# EAGLE design v1 (EAGLE 9.2.2)
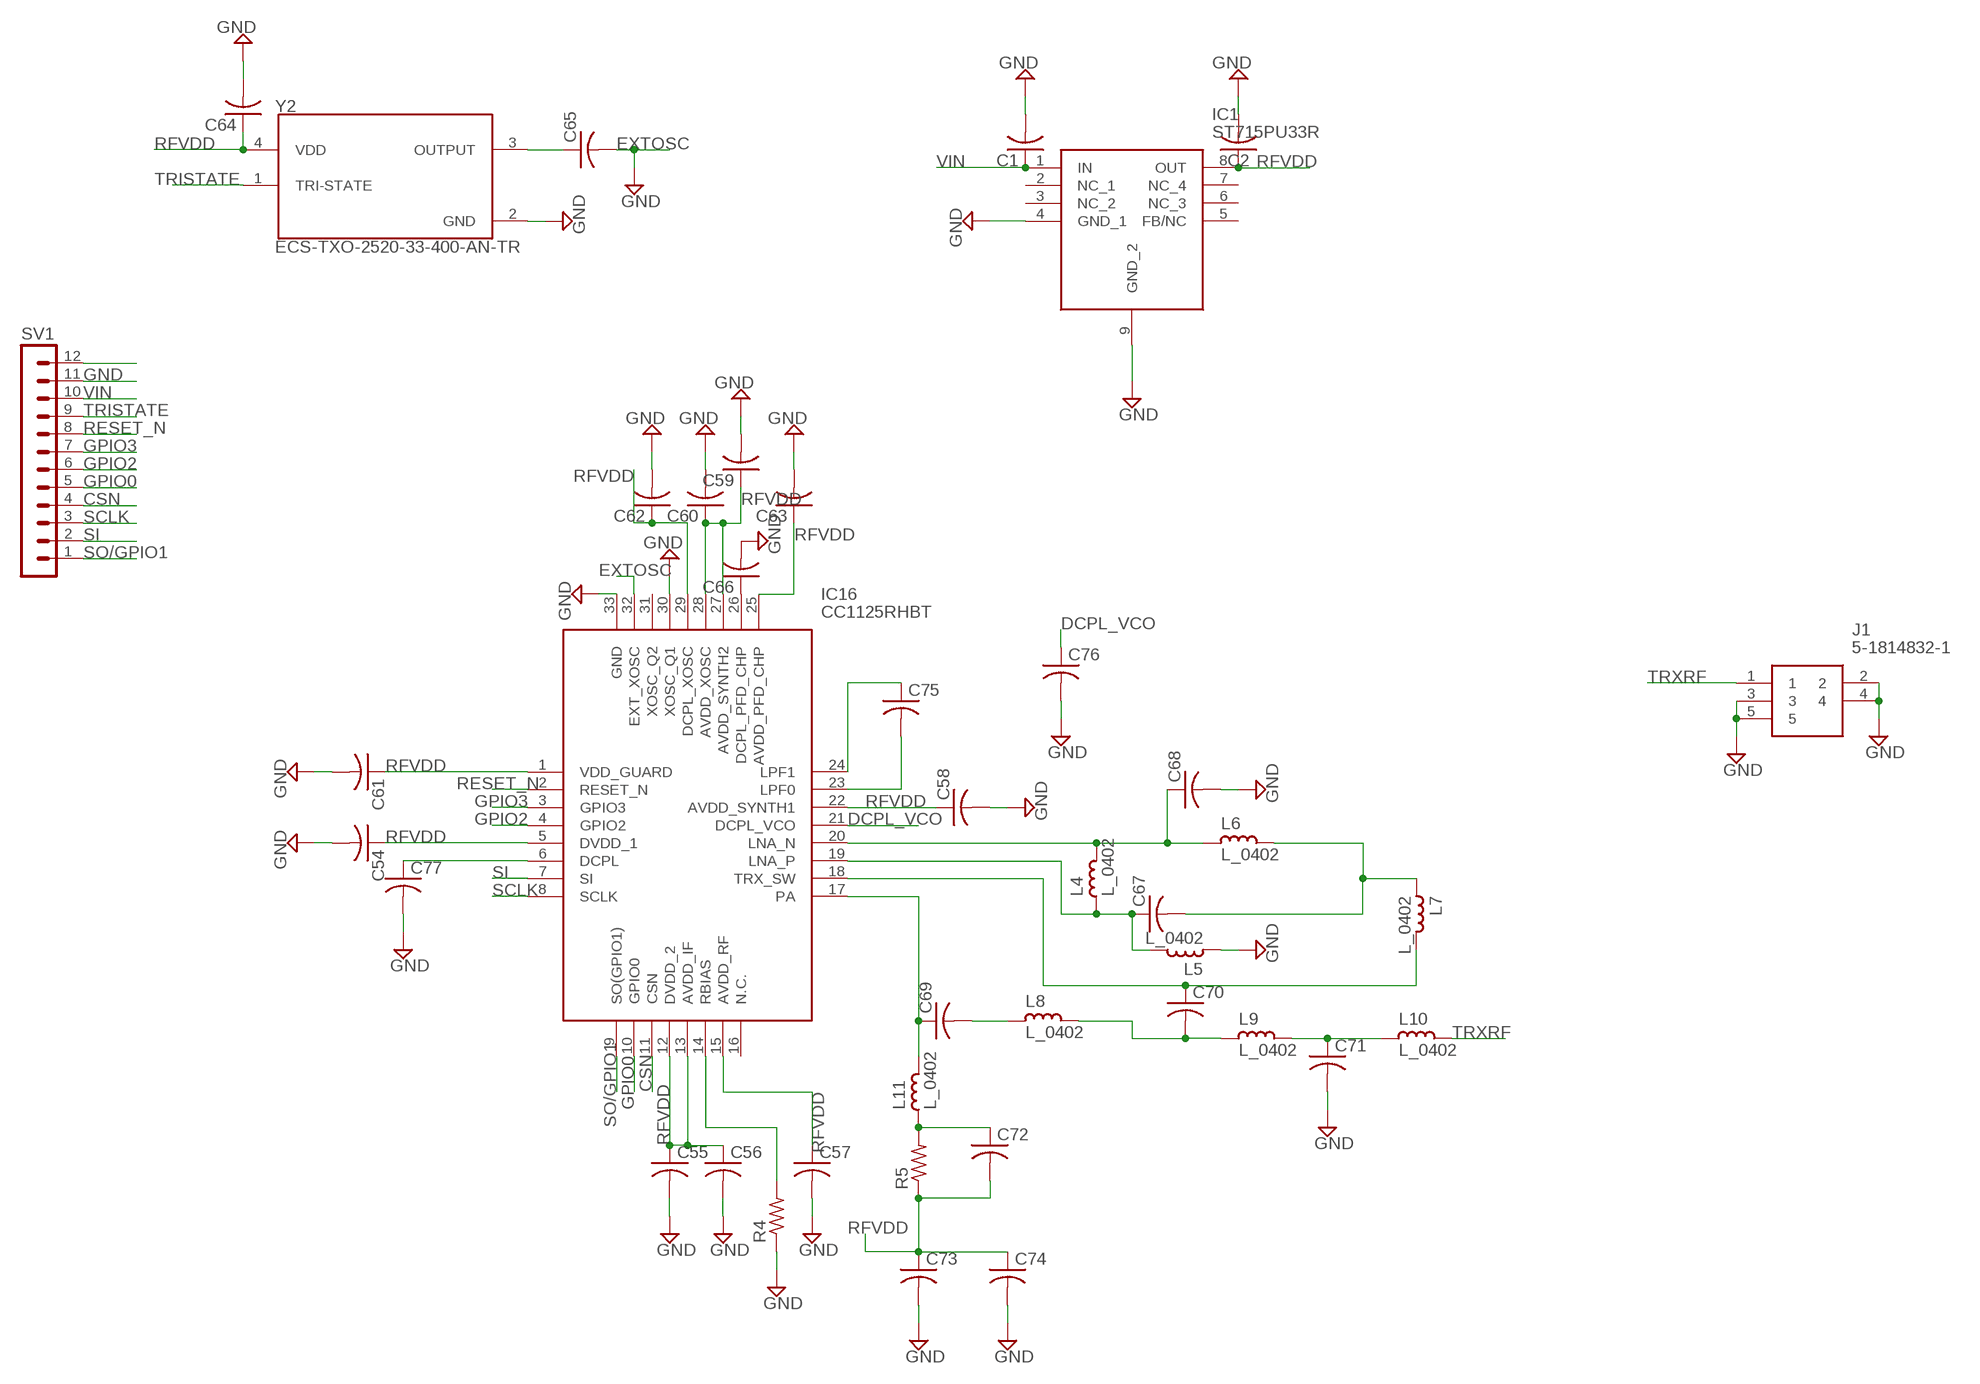
[diagram p0: schematic, sheet 1]

## Parts
C1  C-USC0402  [C0402]
C2  C-USC0402  [C0402]
C54  C-USC0402  [C0402]
C55  C-USC0402  [C0402]
C56  C-USC0402  [C0402]
C57  C-USC0805  [C0805]
C58  C-USC0402  [C0402]
C59  C-USC0402  [C0402]
C60  C-USC0402  [C0402]
C61  C-USC0805  [C0805]
C62  C-USC0402  [C0402]
C63  C-USC0805  [C0805]
C64  C-USC0805  [C0805]
C65  C-USC0402  [C0402]
C66  C-USC0402  [C0402]
C67  C-USC0402  [C0402]
C68  C-USC0402  [C0402]
C69  C-USC0402  [C0402]
C70  C-USC0402  [C0402]
C71  C-USC0402  [C0402]
C72  C-USC0402  [C0402]
C73  C-USC0402  [C0402]
C74  C-USC0402  [C0402]
C75  C-USC0402  [C0402]
C76  C-USC0402  [C0402]
C77  C-USC0402  [C0402]
IC1  ST715PU33R  [SON65P300X300X100-9N]
IC16  CC1125RHBT  [QFN50P500X500X100-33N]
J1  5-1814832-1  [5-1814832-1]
L4  L_0402  [L0402]
L5  L_0402  [L0402]
L6  L_0402  [L0402]
L7  L_0402  [L0402]
L8  L_0402  [L0402]
L9  L_0402  [L0402]
L10  L_0402  [L0402]
L11  L_0402  [L0402]
R4  R-US_R0402  [R0402]
R5  R-US_R0402  [R0402]
SV1  MA12-1  [MA12-1]
Y2  ECS-TXO-2520-33-400-AN-TR  [OSC_ECS-TXO-2520-33-400-AN-TR]

## Nets
CSN [50feed]: IC16.11(CSN) SV1.4
DCPL_VCO: C76.1 IC16.21(DCPL_VCO)
EXTOSC: C65.2 IC16.32(EXT_XOSC) ; supply symbol labelled GND
GND [50feed]: C1.2 C2.2 C54.2 C55.2 C56.2 C57.2 C58.2 C59.2 C60.2 C61.2 C62.2 C63.2 C64.2 C66.2 C68.2 C71.2 C73.2 C74.2 C76.2 C77.2 IC1.4(GND_1) IC1.9(GND_2) IC16.30(XOSC_Q1) IC16.33(GND) J1.2 J1.3 J1.4 J1.5 L5.2 R4.1 SV1.11 Y2.2(GND)
GPIO0 [50feed]: IC16.10(GPIO0) SV1.5
GPIO2 [50feed]: IC16.4(GPIO2) SV1.6
GPIO3 [50feed]: IC16.3(GPIO3) SV1.7
N$12 [50feed]: SV1.12
N$109: IC16.14(RBIAS) R4.2
N$117: C65.1 Y2.3(OUTPUT)
N$121: C66.1 IC16.26(DCPL_PFD_CHP)
N$122 [50feed]: C68.1 IC16.20(LNA_N) L4.1 L6.2
N$123 [50feed]: C67.1 IC16.19(LNA_P) L4.2 L5.1
N$124 [50feed]: C67.2 L6.1 L7.2
N$127 [50feed]: C70.1 IC16.18(TRX_SW) L7.1
N$129 [50feed]: C69.1 IC16.17(PA) L11.1
N$130 [50feed]: C69.2 L8.2
N$131 [50feed]: C70.2 L8.1 L9.2
N$132 [50feed]: C71.1 L9.1 L10.2
N$136: C72.1 L11.2 R5.2
N$140: C77.1 IC16.6(DCPL)
N$141: C75.2 IC16.23(LPF0)
N$142: C75.1 IC16.24(LPF1)
RESET_N [50feed]: IC16.2(RESET_N) SV1.8
RFVDD: C2.1 C54.1 C55.1 C56.1 C57.1 C58.1 C59.1 C60.1 C61.1 C62.1 C63.1 C64.1 C72.2 C73.1 C74.1 IC1.8(OUT) IC16.1(VDD_GUARD) IC16.5(DVDD_1) IC16.12(DVDD_2) IC16.13(AVDD_IF) IC16.15(AVDD_RF) IC16.22(AVDD_SYNTH1) IC16.25(AVDD_PFD_CHP) IC16.27(AVDD_SYNTH2) IC16.28(AVDD_XOSC) IC16.29(DCPL_XOSC) R5.1 Y2.4(VDD)
SCLK [50feed]: IC16.8(SCLK) SV1.3
SI [50feed]: IC16.7(SI) SV1.2
SO/GPIO1 [50feed]: IC16.9(SO(GPIO1)) SV1.1
TRISTATE [50feed]: SV1.9 Y2.1(TRI-STATE)
TRXRF [50feed]: J1.1 L10.1
VIN [50feed]: C1.1 IC1.1(IN) SV1.10
Unconnected: IC1.2(NC_1) IC1.3(NC_2) IC1.5(FB/NC) IC1.6(NC_3) IC1.7(NC_4) IC16.16(N.C.) IC16.31(XOSC_Q2)

## Library data of the parts
C1 C2 C54-C77 = rcl:C-US: CAPACITOR, American symbol; SPICEPREFIX: C
IC1 = ST715PU33R:ST715PU33R: LDO Voltage Regulators High Input Volt 85 mA LDO REG Source: Datasheet <https://componentsearchengine.com/Datasheets/1/ST715PU33R.pdf>; DESCRIPTION: LDO Voltage Regulators High Input Volt 85 mA LDO REG; HEIGHT: 1mm; MANUFACTURER_NAME: STMicroelectronics; MANUFACTURER_PART_NUMBER: ST715PU33R; MOUSER_PART_NUMBER: 511-ST715PU33R; MOUSER_PRICE-STOCK: https://www.mouser.com/Search/Refine.aspx?Keyword=511-ST715PU33R
IC16 = CC1125RHBT:CC1125RHBT: Ultra-High performance Sub-1 GHz Transceiver for Narrowband Systems Source: Datasheet <http://www.ti.com/general/docs/lit/getliterature.tsp?genericPartNumber=CC1125&&fileType=pdf>; DESCRIPTION: Ultra-High performance Sub-1 GHz Transceiver for Narrowband Systems; HEIGHT: 1mm; MANUFACTURER_NAME: Texas Instruments; MANUFACTURER_PART_NUMBER: CC1125RHBT; MOUSER_PART_NUMBER: 595-CC1125RHBT; MOUSER_PRICE-STOCK: https://www.mouser.com/Search/Refine.aspx?Keyword=595-CC1125RHBT
J1 = 5-1814832-1:5-1814832-1: SUBMINIATURE COAX Source: Datasheet <https://componentsearchengine.com/Datasheets/1/5-1814832-1.pdf>; DESCRIPTION: SUBMINIATURE COAX; HEIGHT: mm; MANUFACTURER_NAME: TE Connectivity; MANUFACTURER_PART_NUMBER: 5-1814832-1; MOUSER_PART_NUMBER: 571-5-1814832-1; MOUSER_PRICE-STOCK: https://www.mouser.com/Search/Refine.aspx?Keyword=571-5-1814832-1
L4-L11 = rc-master-smd:L_: INDUCTOR
R4 R5 = rcl:R-US_: RESISTOR, American symbol; SPICEPREFIX: R
SV1 = con-lstb:MA12-1: PIN HEADER; OC_FARNELL: unknown; OC_NEWARK: unknown
Y2 = ECS-TXO-2520-33-400-AN-TR:ECS-TXO-2520-33-400-AN-TR: miniatue SMD HCMOS TCXO Oscillator.; DESCRIPTION: Osc Tcxo 40.0mhz 3.3v Hcmos Smd; DIGI-KEY_PART_NUMBER: XC2260CT-ND; DIGI-KEY_PURCHASE_URL: https://www.digikey.com/product-detail/en/ecs-inc/ECS-TXO-2520-33-400-AN-TR/XC2260CT-ND/6578567?utm_source=snapeda&utm_medium=aggregator&utm_campaign=symbol; MF: ECS Inc.; MP: ECS-TXO-2520-33-400-AN-TR; PACKAGE: SMD-4 ECS International

## Net classes
1 50feed: width 0.147 mm

## Board
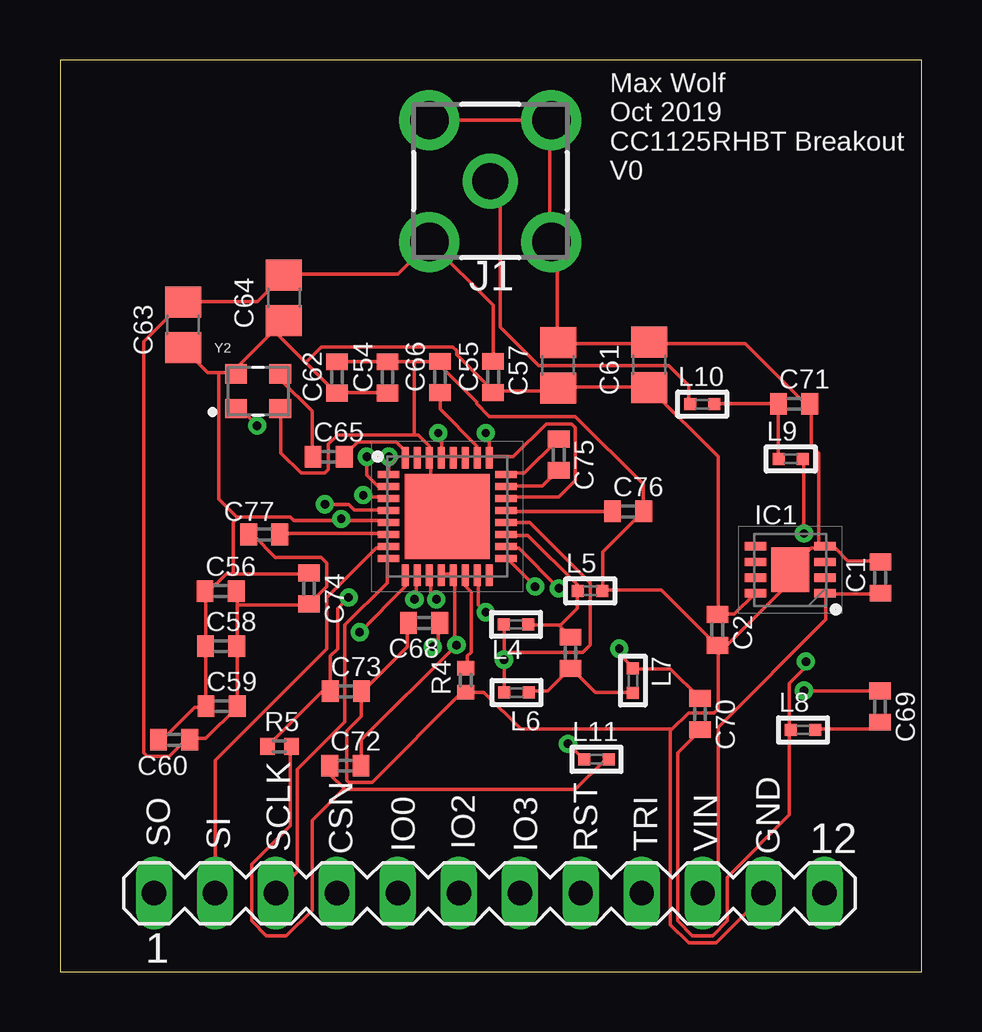
[diagram p1: board, top side]
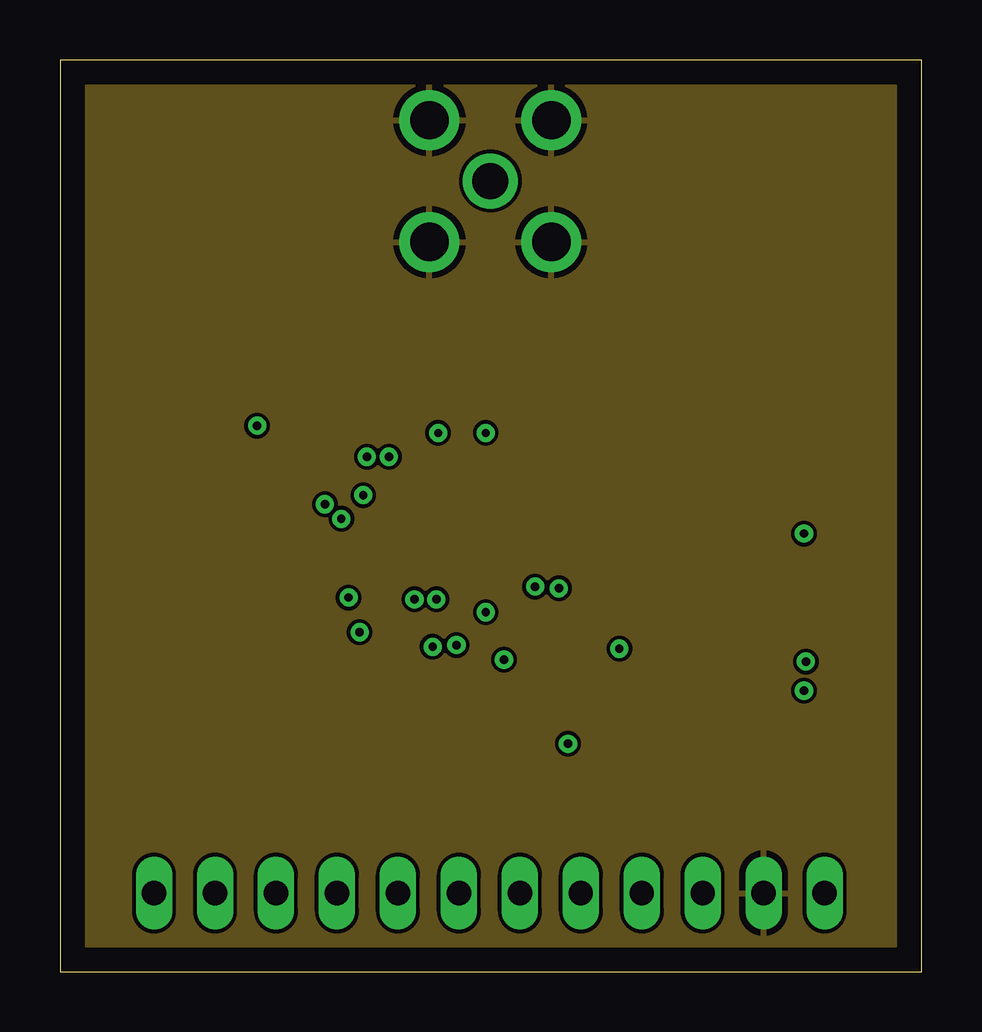
[diagram p2: board, inner layer Route2]
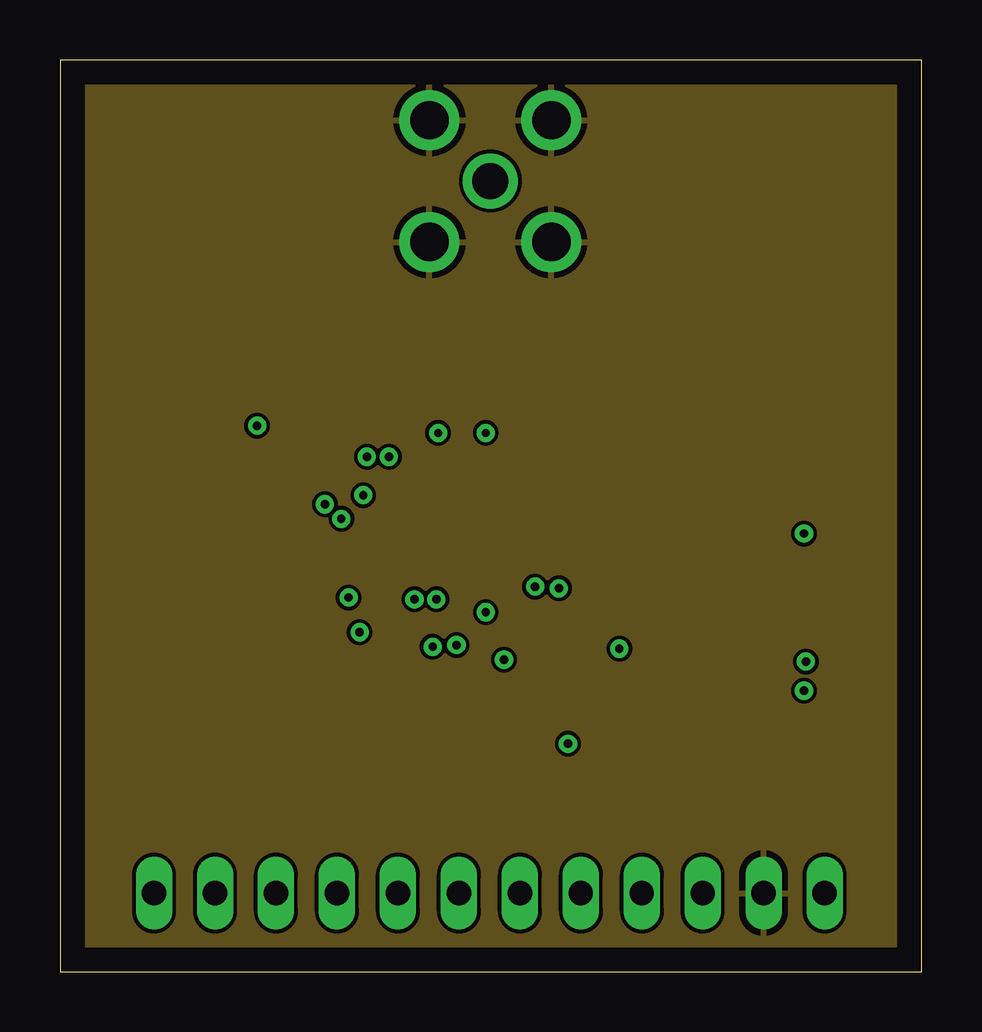
[diagram p3: board, inner layer Route15]
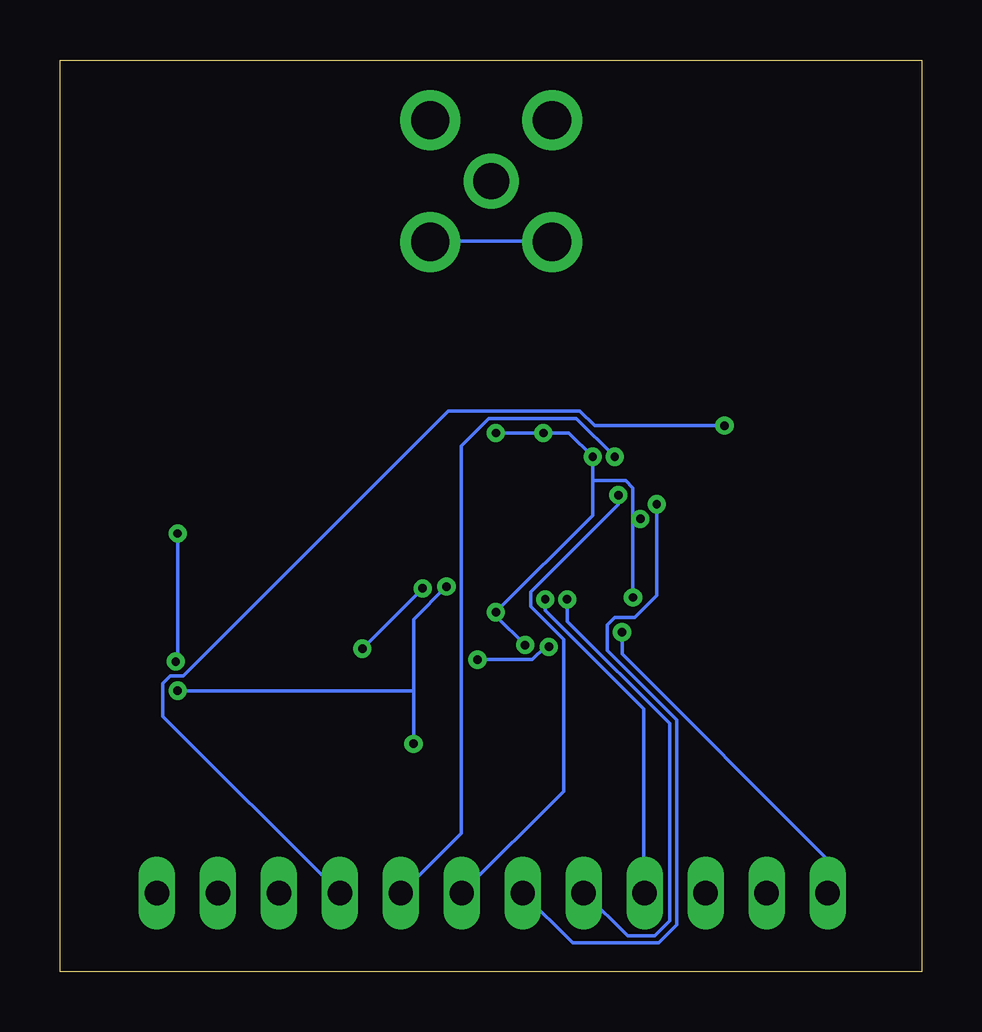
[diagram p4: board, bottom side, seen from below]

Size 35.9 x 38 mm. Coordinates in mm from the lower left corner, seen from the top.
Outline: 0,0 35.9,0 35.9,38 0,38 0,0
Copper layers (1+2*15+16): Top 0.035mm / dielectric 0.1mm / Route2 0.0175mm / dielectric 1.265mm / Route15 0.0175mm / dielectric 0.1mm / Bottom 0.035mm
Design rules "default *": minimum track width 6mil, minimum drill 0.35mm, track to track 6mil, track to pad 6mil, pad to pad 6mil, via to via 6mil, smd to smd 6mil, copper to edge 40mil, drill to drill 6mil, minimum pad ring 10mil, minimum via ring 8mil, stop-mask expansion 4mil, vias tented up to drill 0mil, thermal gap 10mil

### Footprints (pad centres in the part's own frame; a part is rotated, then mirrored left to right if it is on the bottom)
C0402 = smd 0.7 x 0.9: 1 -0.65,0; 2 0.65,0
C0805 = smd 1.3 x 1.5: 1 -0.95,0; 2 0.95,0
SON65P300X300X100-9N = smd 0.9 x 0.35: 1 -1.45,0.975; 2 -1.45,0.325; 3 -1.45,-0.325; 4 -1.45,-0.975; 5 1.45,-0.975; 6 1.45,-0.325; 7 1.45,0.325; 8 1.45,0.975 | smd 1.595 x 1.853: 9 0,0
QFN50P500X500X100-33N = smd 0.9 x 0.3: 1 -2.45,1.75; 2 -2.45,1.25; 3 -2.45,0.75; 4 -2.45,0.25; 5 -2.45,-0.25; 6 -2.45,-0.75; 7 -2.45,-1.25; 8 -2.45,-1.75; 17 2.45,-1.75; 18 2.45,-1.25; 19 2.45,-0.75; 20 2.45,-0.25; 21 2.45,0.25; 22 2.45,0.75; 23 2.45,1.25; 24 2.45,1.75 | smd 0.3 x 0.9: 9 -1.75,-2.45; 10 -1.25,-2.45; 11 -0.75,-2.45; 12 -0.25,-2.45; 13 0.25,-2.45; 14 0.75,-2.45; 15 1.25,-2.45; 16 1.75,-2.45; 25 1.75,2.45; 26 1.25,2.45; 27 0.75,2.45; 28 0.25,2.45; 29 -0.25,2.45; 30 -0.75,2.45; 31 -1.25,2.45; 32 -1.75,2.45 | smd 3.55 x 3.55: 33 0,0
5-1814832-1 = drill 1.5 pad 2.3: 1 0,0 | drill 1.6 pad 2.5: 2 -2.54,-2.54; 3 2.54,-2.54; 4 2.54,2.54; 5 -2.54,2.54
L0402 = smd 0.5 x 0.5: 1 -0.508,0; 2 0.508,0
R0402 = smd 0.6 x 0.7: 1 -0.5,0; 2 0.5,0
MA12-1 = drill 1.016 long: 1 -13.97,0; 2 -11.43,0; 3 -8.89,0; 4 -6.35,0; 5 -3.81,0; 6 -1.27,0; 7 1.27,0; 8 3.81,0; 9 6.35,0; 10 8.89,0; 11 11.43,0; 12 13.97,0
OSC_ECS-TXO-2520-33-400-AN-TR = smd 0.9 x 0.8: 1 -0.925,-0.725; 2 0.925,-0.725; 3 0.925,0.725; 4 -0.925,0.725

### Placement (x,y rotation side)
C1  34.18,16.42 90 top
C2  27.39,14.24 270 top
C54  13.65,24.77 90 top
C55  18.05,24.79 90 top
C56  6.69,15.86 0 top
C57  20.75,25.27 90 top
C58  6.71,13.56 0 top
C59  6.73,11.06 0 top
C60  4.75,9.66 0 top
C61  24.55,25.29 90 top
C62  11.54,24.77 90 top
C63  5.13,26.96 90 top
C64  9.33,28.08 90 top
C65  11.19,21.46 0 top
C66  15.83,24.79 90 top
C67  21.27,13.29 270 top
C68  15.17,14.53 180 top
C69  34.17,11.05 270 top
C70  26.67,10.73 270 top
C71  30.59,23.67 0 top
C72  11.89,8.58 0 top
C73  11.91,11.68 0 top
C74  10.38,15.97 270 top
C75  20.78,21.55 270 top
C76  23.67,19.18 0 top
C77  8.51,18.22 180 top
IC1  30.43,16.75 180 top
IC16  16.14,18.97 0 top
J1  17.93,32.95 270 top
L4  19,14.47 0 top
L5  22.09,15.87 0 top
L6  19.02,11.63 180 top
L7  23.87,12.13 270 top
L8  30.96,10.07 0 top
L9  30.45,21.37 0 top
L10  26.76,23.65 0 top
L11  22.35,8.85 0 top
R4  16.91,12.15 90 top
R5  9.14,9.39 0 top
SV1  17.89,3.27 0 top
Y2  8.25,24.19 0 top

### Tracks (layer width: path | path; a pad name or v marks a point on that pad's centre or on a via)
CSN  (via drill 0.35)
  Top 0.152: v15.68,15.52 15.45,15.74 15.45,16.51 IC16.11
  Bottom 0.152: v15.68,15.52 15.68,15.06 11.57,10.94 11.57,3.32 SV1.4
DCPL_VCO
  Top 0.152: C76.1 23,19.17 18.65,19.17 IC16.21
EXTOSC
  Top 0.152: C65.2 11.87,21.54 12.41,22.07 14.01,22.07 14.39,21.69 14.39,21.46 IC16.32
GND
  Top 0.152: C62.2 11.57,25.42 13.62,25.42 C54.2 13.7,25.42 14.77,25.42 | 14.77,25.42 15.76,25.42 C66.2 15.76,25.34 17.36,23.75 17.36,23.67 17.89,23.14 21.47,23.14 24.29,20.32 24.29,19.25 C76.2 24.29,19.17 22.62,17.5 22.62,15.9 L5.2 22.69,15.9 25.05,15.9 27.34,13.61 C2.2 | IC16.33 16.14,19.02 15.45,19.71 15.45,21.38 IC16.30 15.38,21.46 15.38,21.92 14.92,22.37 14.77,22.37 | 14.77,22.37 11.57,22.37 11.19,21.99 11.19,20.93 11.04,20.77 10.04,20.77 9.21,21.61 9.21,23.44 Y2.2 | 14.77,22.37 14.77,25.42 | C68.2 14.46,14.53 14.46,13.53 12.63,11.71 C73.2 12.56,11.63 12.56,10.64 11.95,10.03 11.95,7.97 12.03,7.9 13.02,7.9 16.75,11.63 16.9,11.63 R4.1 16.98,11.63 17.66,11.63 19.19,10.11 25.44,10.11 25.47,10.07 | C2.2 27.42,13.61 27.8,13.61 30.39,16.2 30.39,16.73 IC1.9 30.47,16.81 31.3,17.65 31.61,17.65 | 31.61,17.65 31.84,17.65 IC1.4 | 31.61,17.65 31.61,21.61 31.3,21.92 31.3,23.67 C71.2 31.23,23.75 31,23.75 28.56,26.18 24.6,26.18 C61.2 24.52,26.18 20.79,26.18 C57.2 20.71,26.26 20.71,30.15 20.48,30.38 J1.4 20.41,30.45 20.41,35.4 J1.5 20.41,35.48 15.45,35.48 J1.2 | 31.61,17.65 IC1.4 | C1.2 34.12,17.12 32.83,17.12 32.29,17.65 31.91,17.65 IC1.4 | 25.47,10.07 26.2,10.79 27.26,10.79 27.42,10.94 27.42,13.53 C2.2 | 25.47,10.07 25.44,10.03 25.44,1.95 26.2,1.19 27.34,1.19 29.25,3.09 29.25,3.25 SV1.11 | 7.38,15.29 7.38,13.61 C58.2 7.38,13.53 7.38,11.1 C59.2 7.38,11.02 6.08,9.72 5.47,9.72 C60.2 5.4,9.65 5.24,9.65 4.56,8.96 3.64,8.96 3.49,9.12 3.49,26.26 5.09,27.86 C63.2 5.17,27.94 8.21,27.94 9.28,29 C64.2 9.36,29.08 14.08,29.08 15.38,30.38 J1.3 15.45,30.38 18.04,27.78 18.04,25.5 C55.2
  Top 0.152: 7.38,15.29 7.38,15.82 C56.2 | 7.38,15.29 10.35,15.29 C74.2 10.43,15.36 11.11,16.05 11.11,17.04 10.88,17.27 8.98,17.27 8.06,18.18 7.91,18.18 C77.2
  Bottom 0.152: J1.4 20.41,30.45 15.45,30.45 J1.3
  pour Route2: -0.1,38 -0.1,0 35.9,0 35.9,38
  pour Route15: -0.1,38 -0.1,0 35.9,0 35.9,38
GPIO0  (via drill 0.35)
  Top 0.152: v14.77,15.52 14.85,15.59 14.85,16.51 IC16.10
  Bottom 0.152: v14.77,15.52 14.77,14.6 10.5,10.33 10.5,2.1 11.11,1.5 12.25,1.5 14.01,3.25 SV1.5
GPIO2  (via drill 0.35)
  Top 0.152: v11.04,19.48 12.03,19.48 12.25,19.25 13.62,19.25 IC16.4
  Bottom 0.152: v11.04,19.48 11.04,15.67 11.95,14.75 12.79,14.75 13.09,14.45 13.09,13.38 10.2,10.49 10.2,1.95 10.96,1.19 14.54,1.19 16.6,3.25 SV1.6
GPIO3  (via drill 0.35)
  Top 0.152: v12.63,19.86 12.71,19.78 13.62,19.78 IC16.3
  Bottom 0.152: v12.63,19.86 12.63,19.48 16.29,15.82 16.29,15.21 14.92,13.84 14.92,7.52 19.11,3.32 SV1.7
N$109
  Top 0.152: R4.2 16.98,12.7 16.98,13.15 17.13,13.31 17.13,15.82 16.9,16.05 16.9,16.51 IC16.14
N$117
  Top 0.152: Y2.3 9.21,24.89 9.21,24.66 10.5,23.36 10.5,21.54 C65.1
N$121
  Top 0.152: C66.1 15.84,24.13 15.84,23.44 17.36,21.92 17.36,21.46 IC16.26
N$122  (via drill 0.35)
  Top 0.152: 18.5,13.31 18.5,14.45 L4.1 | L6.2 18.5,11.71 v18.5,13 18.5,13.31 | v15.53,13.53 15.76,13.76 15.76,14.53 C68.1 | 18.5,13.31 21.78,13.31 22.08,13.61 22.08,16.2 19.57,18.72 18.65,18.72 IC16.20
  Bottom 0.152: v15.53,13.53 15.68,13.53 16.22,13 v18.5,13
N$123
  Top 0.152: 20.83,14.41 21.24,13.99 C67.1 | 20.83,14.41 20.79,14.45 19.57,14.45 L4.2 | 20.83,14.41 21.55,15.13 21.55,15.82 L5.1 21.55,15.9 21.55,16.12 19.49,18.18 18.65,18.18 IC16.19
N$124
  Top 0.152: L7.2 23.84,11.63 22.31,11.63 21.32,12.62 C67.2 21.24,12.62 20.33,11.71 19.57,11.71 L6.1
N$127  (via drill 0.35)
  Top 0.152: C70.1 26.66,11.4 25.44,12.62 23.91,12.62 L7.1 23.84,12.7 23.3,13.23 v23.3,13.46 | v20.79,15.97 19.11,17.65 18.65,17.65 IC16.18
  Bottom 0.152: v23.3,13.46 v20.79,15.97
N$129  (via drill 0.35)
  Top 0.152: v21.17,9.5 21.78,8.89 L11.1 | v19.8,16.05 18.65,17.19 IC16.17 | v31,11.71 34.12,11.71 C69.1
  Bottom 0.152: 21.17,11.71 21.17,14.68 v19.8,16.05 | 21.17,11.71 v21.17,9.5 | 21.17,11.71 v31,11.71
N$130
  Top 0.152: L8.2 31.53,10.11 33.89,10.11 34.12,10.33 C69.2
N$131  (via drill 0.35)
  Top 0.152: C70.2 26.66,10.03 25.74,9.12 25.74,2.1 26.35,1.5 27.19,1.5 27.8,2.1 27.8,3.93 30.39,6.52 30.39,10.03 L8.1 30.39,10.11 30.39,12.01 31.07,12.7 v31.07,12.93 | v31,18.26 31,21.31 L9.2
  Bottom 0.152: v31,18.26 31,13 v31.07,12.93
N$132
  Top 0.152: L9.1 29.93,21.38 C71.1 29.86,23.67 27.34,23.67 L10.2
N$136
  Top 0.152: 11.84,7.63 11.26,8.2 11.26,8.5 C72.1 | 11.84,7.63 11.87,7.59 21.47,7.59 22.69,8.81 22.85,8.81 L11.2 | 11.84,7.63 10.5,6.29 10.5,2.56 9.43,1.5 8.6,1.5 7.99,2.1 7.99,4.47 9.59,6.07 9.59,9.34 R5.2
N$140
  Top 0.152: C77.1 9.21,18.26 13.62,18.26 IC16.6
N$141
  Top 0.152: IC16.23 18.65,20.24 20.1,20.24 20.71,20.85 C75.2
N$142
  Top 0.152: IC16.24 18.65,20.77 19.34,20.77 20.71,22.14 C75.1
RESET_N  (via drill 0.35)
  Top 0.152: v12.79,21.46 12.79,20.7 13.24,20.24 13.62,20.24 IC16.2
  Bottom 0.152: v12.79,21.46 14.39,23.06 18.04,23.06 19.19,21.92 19.19,5.76 21.63,3.32 SV1.8
RFVDD  (via drill 0.35)
  Top 0.152: IC16.22 18.65,19.78 20.79,19.78 21.47,20.47 21.47,22.68 21.32,22.83 20.25,22.83 18.88,21.46 17.89,21.46 IC16.25 17.89,21.54 17.89,22.3 v17.74,22.45 | R5.1 8.67,9.42 10.88,11.63 11.19,11.63 C73.1 11.26,11.71 11.26,13.15 11.57,13.46 11.57,15.13 v12.03,15.59 | IC16.27 16.83,21.46 16.45,21.46 IC16.28 16.37,21.46 15.91,21.46 IC16.29 15.91,21.54 15.91,22.3 v15.76,22.45 | 16.45,13.61 16.45,16.51 IC16.13 16.37,16.58 15.91,16.58 IC16.12 | 16.45,13.61 16.45,13.53 12.56,9.65 12.56,8.58 C72.2 | v17.74,14.98 17.43,15.29 17.43,16.51 IC16.15 | 16.45,13.61 v16.52,13.61 | v13.7,21.46 13.7,20.77 IC16.1 | IC1.8 28.94,15.74 28.1,14.91 27.42,14.91 C2.1 27.42,14.98 27.42,21.46 24.6,24.28 C61.1 24.52,24.36 20.79,24.36 C57.1 20.71,24.28 20.64,24.2 18.12,24.2 C55.1 18.04,24.2 16.52,25.73 16.52,25.88 16.37,26.03 10.88,26.03 10.24,25.38 | C54.1 13.62,24.13 11.57,24.13 C62.1 11.49,24.13 10.24,25.38 | 6.62,24.96 6.16,24.96 5.17,25.95 C63.1 | 6.62,24.96 7.3,24.96 Y2.4 7.3,25.04 7.3,25.12 8.9,26.72 | 8.9,26.72 9.28,27.1 C64.1 8.9,26.72 | 8.9,26.72 10.24,25.38 | C60.1 4.1,9.72 4.33,9.72 5.62,11.02 6.01,11.02 C59.1 6.08,11.1 6.08,13.53 C58.1 6.08,13.61 6.08,15.82 C56.1 6.16,15.82 6.92,16.58 7.23,16.58 | 7.23,16.58 10.35,16.58 C74.1 | 11.72,18.79 9.74,18.79 9.59,18.95 7.45,18.95 7.42,18.91 | 11.72,18.79 13.62,18.79 IC16.5 | 7.42,18.91 7.23,18.72 7.23,16.58 | 6.62,24.96 6.62,19.71 7.42,18.91 | 11.72,18.79 v11.72,18.87
  Bottom 0.152: v16.52,13.61 17.74,14.83 v17.74,14.98 13.7,19.02 13.7,20.47 | 13.7,20.47 v13.7,21.46 14.69,22.45 v15.76,22.45 v17.74,22.45 | 12.03,18.87 12.03,20.16 12.33,20.47 13.7,20.47 | 12.03,18.87 v12.03,15.59 | v11.72,18.87 12.03,18.87
SCLK
  Top 0.152: IC16.8 13.62,17.19 13.62,16.2 11.87,14.45 11.87,10.41 9.89,8.43 9.89,4.16 9.05,3.32 SV1.3
SI
  Top 0.152: IC16.7 13.62,17.65 13.17,17.65 11.11,15.59 11.11,13.46 6.46,8.81 6.46,3.32 SV1.2
SO/GPIO1  (via drill 0.35)
  Top 0.152: v12.48,14.14 14.39,16.05 14.39,16.51 IC16.9
  Bottom 0.152: v12.48,14.14 12.48,13.23 3.95,4.7 3.95,3.32 SV1.1
TRISTATE  (via drill 0.35)
  Top 0.152: v8.21,22.75 7.53,23.44 7.38,23.44 Y2.1
  Bottom 0.152: v8.21,22.75 13.62,22.75 14.24,23.36 19.72,23.36 30.77,12.32 31.3,12.32 31.61,12.01 31.61,10.64 24.29,3.32 SV1.9
TRXRF
  Top 0.152: L10.1 26.2,23.67 26.2,24.43 25.36,25.27 19.95,25.27 18.35,26.87 18.35,32.51 17.97,32.89 J1.1
VIN
  Top 0.152: C1.1 34.12,15.74 31.91,15.74 IC1.1 31.91,15.67 31.91,14.68 27.42,10.18 27.42,3.93 26.81,3.32 SV1.10

### Text on the board
tNames: Max Wolf / Oct 2019 / CC1125RHBT Breakout / V0 | SO | SI | SCLK | CSN | IO0 | IO2 | IO3 | RST | TRI | VIN | GND